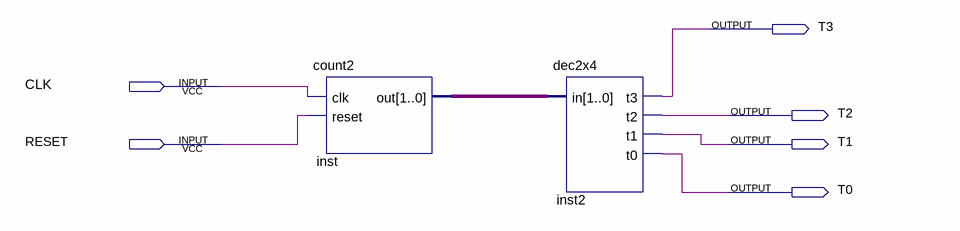
[diagram p0: schematic sheet]
// Quartus schematic blockD3.bdf as structural Verilog: 2 symbols, 6 pins
module blockD3 (
  input  CLK,
  input  RESET,
  output T3,
  output T2,
  output T1,
  output T0
);

  wire [1:0] inst_out;

  count2 inst (.clk(CLK), .reset(RESET), .out(inst_out));
  dec2x4 inst2 (.in(inst_out), .t3(T3), .t2(T2), .t1(T1), .t0(T0));
endmodule
